# EAGLE design HVAC8-3 (EAGLE 7.5.0)
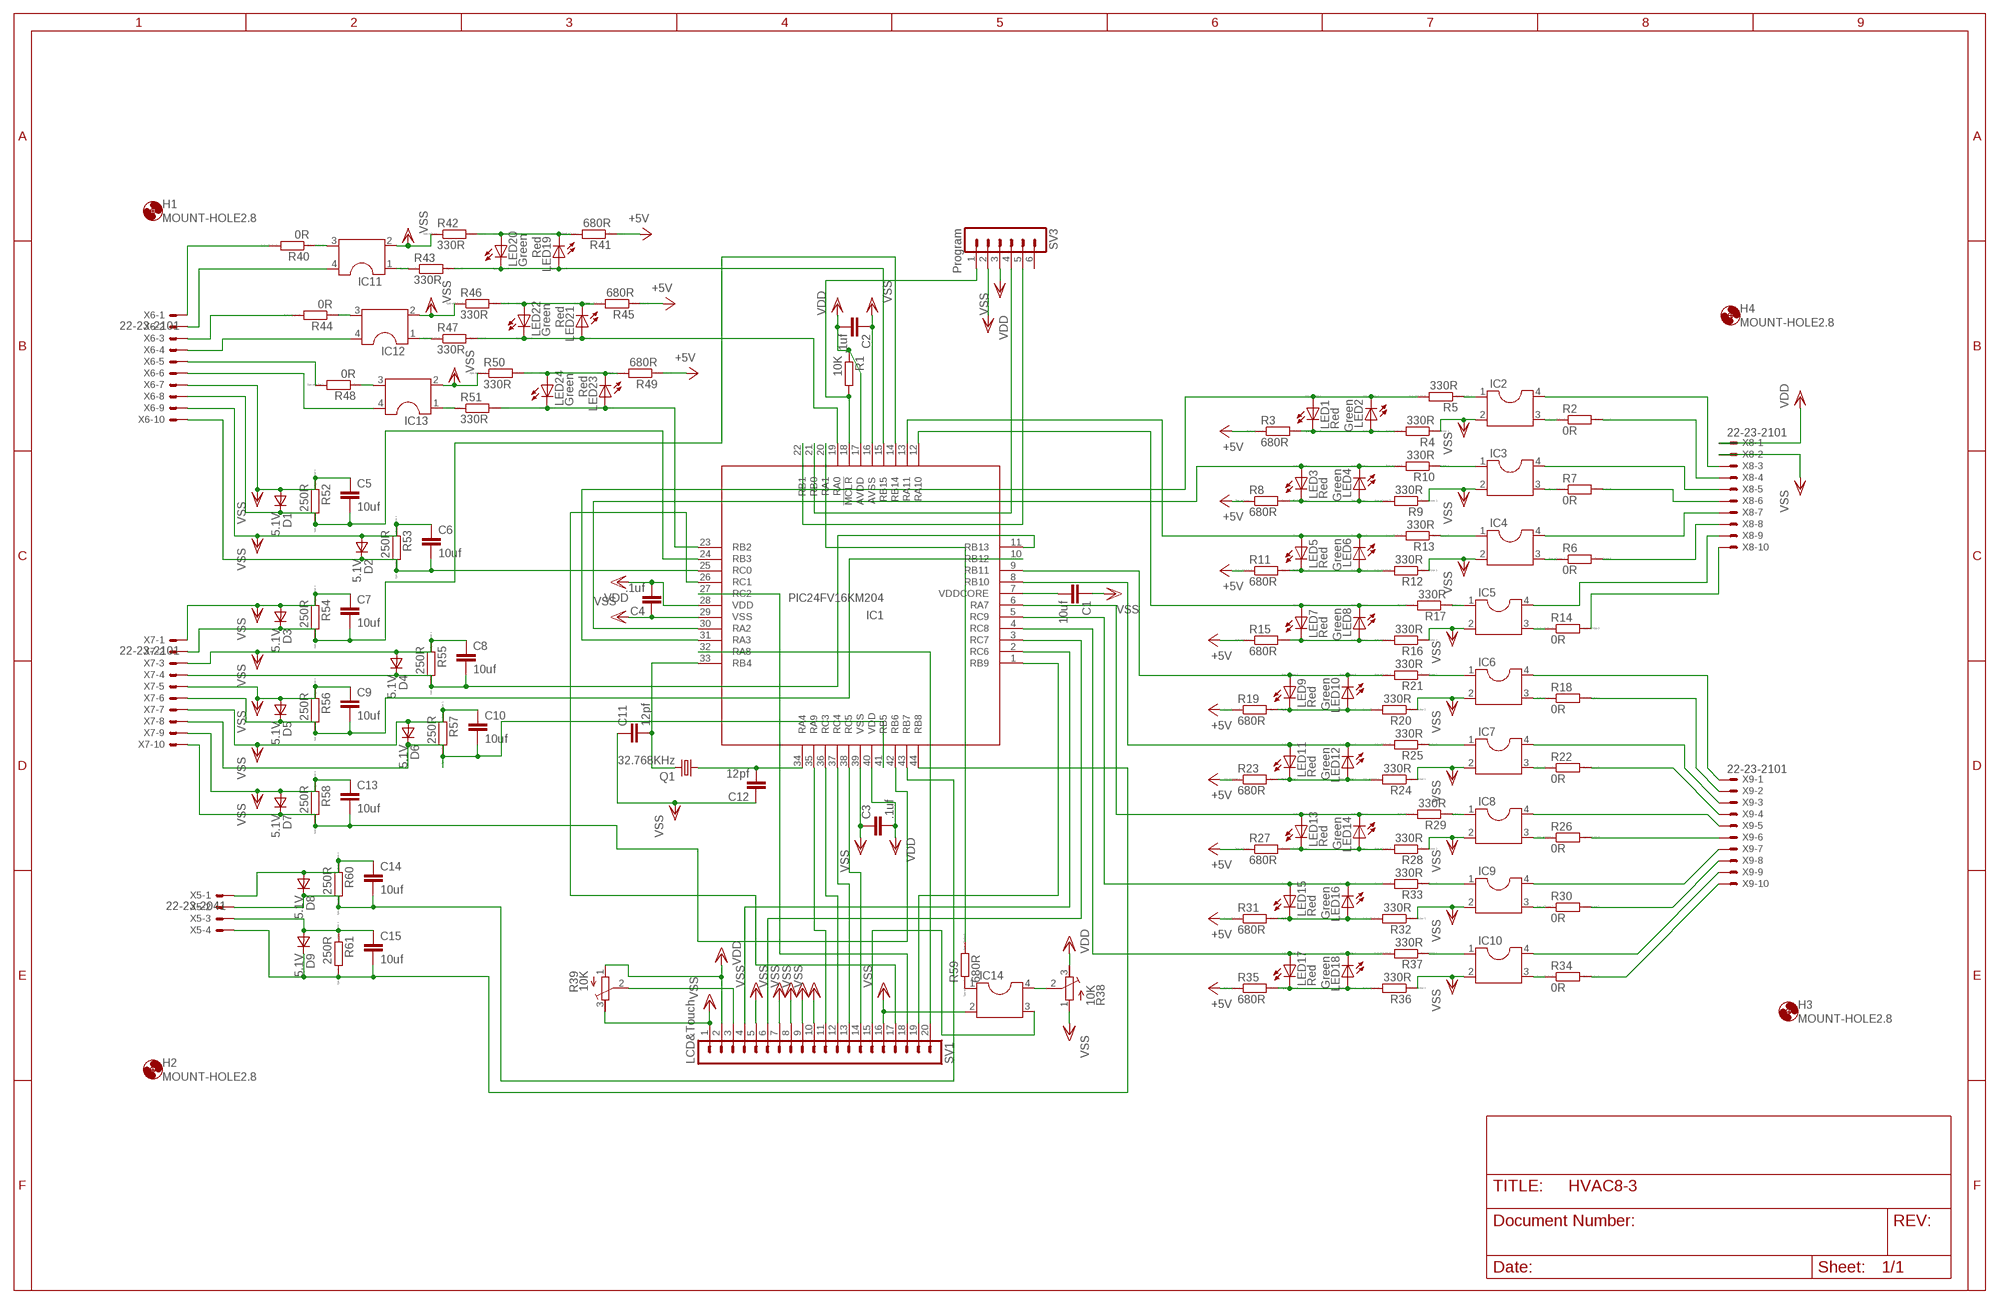
[diagram p0: schematic, sheet 1]

## Parts
C1  10uf  C-EUC1206  [C1206]
C2  .1uf  C-EUC1206  [C1206]
C3  .1uf  C-EUC1206  [C1206]
C4  .1uf  C-EUC1206  [C1206]
C5  10uf  C-EUC1206  [C1206]
C6  10uf  C-EUC1206  [C1206]
C7  10uf  C-EUC1206  [C1206]
C8  10uf  C-EUC1206  [C1206]
C9  10uf  C-EUC1206  [C1206]
C10  10uf  C-EUC1206  [C1206]
C11  12pf  C-EUC0603  [C0603]
C12  12pf  C-EUC0603  [C0603]
C13  10uf  C-EUC1206  [C1206]
C14  10uf  C-EUC1206  [C1206]
C15  10uf  C-EUC1206  [C1206]
D1  5.1V  DSOD323  [SOD323]
D2  5.1V  DSOD323  [SOD323]
D3  5.1V  DSOD323  [SOD323]
D4  5.1V  DSOD323  [SOD323]
D5  5.1V  DSOD323  [SOD323]
D6  5.1V  DSOD323  [SOD323]
D7  5.1V  DSOD323  [SOD323]
D8  5.1V  DSOD323  [SOD323]
D9  5.1V  DSOD323  [SOD323]
H1  MOUNT-HOLE2.8  [2,8]
H2  MOUNT-HOLE2.8  [2,8]
H3  MOUNT-HOLE2.8  [2,8]
H4  MOUNT-HOLE2.8  [2,8]
IC1  PIC24FV16KM204  [TQFP44]
IC2  DIL4S  [SOCKET-04]
IC3  DIL4S  [SOCKET-04]
IC4  DIL4S  [SOCKET-04]
IC5  DIL4S  [SOCKET-04]
IC6  DIL4S  [SOCKET-04]
IC7  DIL4S  [SOCKET-04]
IC8  DIL4S  [SOCKET-04]
IC9  DIL4S  [SOCKET-04]
IC10  DIL4S  [SOCKET-04]
IC11  DIL4S  [SOCKET-04]
IC12  DIL4S  [SOCKET-04]
IC13  DIL4S  [SOCKET-04]
IC14  DIL4S  [SOCKET-04]
LED1  Red  LED_E  [LED_1206]
LED2  Green  LED_E  [LED_1206]
LED3  Red  LED_E  [LED_1206]
LED4  Green  LED_E  [LED_1206]
LED5  Red  LED_E  [LED_1206]
LED6  Green  LED_E  [LED_1206]
LED7  Red  LED_E  [LED_1206]
LED8  Green  LED_E  [LED_1206]
LED9  Red  LED_E  [LED_1206]
LED10  Green  LED_E  [LED_1206]
LED11  Red  LED_E  [LED_1206]
LED12  Green  LED_E  [LED_1206]
LED13  Red  LED_E  [LED_1206]
LED14  Green  LED_E  [LED_1206]
LED15  Red  LED_E  [LED_1206]
LED16  Green  LED_E  [LED_1206]
LED17  Red  LED_E  [LED_1206]
LED18  Green  LED_E  [LED_1206]
LED19  Red  LED_E  [LED_1206]
LED20  Green  LED_E  [LED_1206]
LED21  Red  LED_E  [LED_1206]
LED22  Green  LED_E  [LED_1206]
LED23  Red  LED_E  [LED_1206]
LED24  Green  LED_E  [LED_1206]
Q1  32.768KHz  CRYSTALTC26H  [TC26H]
R1  10K  R-EU_R1206  [R1206]
R2  0R  RR1206  [R1206]
R3  680R  RR1206  [R1206]
R4  330R  RR1206  [R1206]
R5  330R  RR1206  [R1206]
R6  0R  RR1206  [R1206]
R7  0R  RR1206  [R1206]
R8  680R  RR1206  [R1206]
R9  330R  RR1206  [R1206]
R10  330R  RR1206  [R1206]
R11  680R  RR1206  [R1206]
R12  330R  RR1206  [R1206]
R13  330R  RR1206  [R1206]
R14  0R  RR1206  [R1206]
R15  680R  RR1206  [R1206]
R16  330R  RR1206  [R1206]
R17  330R  RR1206  [R1206]
R18  0R  RR1206  [R1206]
R19  680R  RR1206  [R1206]
R20  330R  RR1206  [R1206]
R21  330R  RR1206  [R1206]
R22  0R  RR1206  [R1206]
R23  680R  RR1206  [R1206]
R24  330R  RR1206  [R1206]
R25  330R  RR1206  [R1206]
R26  0R  RR1206  [R1206]
R27  680R  RR1206  [R1206]
R28  330R  RR1206  [R1206]
R29  330R  RR1206  [R1206]
R30  0R  RR1206  [R1206]
R31  680R  RR1206  [R1206]
R32  330R  RR1206  [R1206]
R33  330R  RR1206  [R1206]
R34  0R  RR1206  [R1206]
R35  680R  RR1206  [R1206]
R36  330R  RR1206  [R1206]
R37  330R  RR1206  [R1206]
R38  10K  R-TRIMM3296W  [RTRIM3296W]
R39  10K  R-TRIMM3296W  [RTRIM3296W]
R40  0R  RR1206  [R1206]
R41  680R  RR1206  [R1206]
R42  330R  RR1206  [R1206]
R43  330R  RR1206  [R1206]
R44  0R  RR1206  [R1206]
R45  680R  RR1206  [R1206]
R46  330R  RR1206  [R1206]
R47  330R  RR1206  [R1206]
R48  0R  RR1206  [R1206]
R49  680R  RR1206  [R1206]
R50  330R  RR1206  [R1206]
R51  330R  RR1206  [R1206]
R52  250R  RR1206  [R1206]
R53  250R  RR1206  [R1206]
R54  250R  RR1206  [R1206]
R55  250R  RR1206  [R1206]
R56  250R  RR1206  [R1206]
R57  250R  RR1206  [R1206]
R58  250R  RR1206  [R1206]
R59  680R  RR1206  [R1206]
R60  250R  RR1206  [R1206]
R61  250R  RR1206  [R1206]
SV1  LCD&Touch  MA20-1  [MA20-1]
SV3  Program  MA06-1  [MA06-1]
X5  22-23-2041  [22-23-2041]
X6  22-23-2101  [22-23-2101]
X7  22-23-2101  [22-23-2101]
X8  22-23-2101  [22-23-2101]
X9  22-23-2101  [22-23-2101]

## Nets
+5V: R3.1 R8.1 R11.1 R15.1 R19.1 R23.1 R27.1 R31.1 R35.1 R41.1 R45.1 R49.1
N$1: IC13.1 R51.1
N$2: IC1.18(!MCLR) R1.2 SV3.1
N$3: IC2.1 R5.1
N$4: IC1.12(RA10) LED7.A LED8.C R17.2
N$5: IC2.4 X8.3
N$6: LED1.C LED2.A R3.2 R4.2
N$7: IC2.3 R2.1
N$8: IC3.1 R10.1
N$9: R2.2 X8.4
N$10: IC3.4 X8.5
N$11: LED3.C LED4.A R8.2 R9.2
N$12: IC3.3 R7.1
N$13: IC11.1 R43.1
N$14: R7.2 X8.6
N$15: IC4.1 R13.1
N$16: LED5.C LED6.A R11.2 R12.2
N$17: IC4.3 R6.1
N$18: LED19.C LED20.A R41.2 R42.2
N$19: R14.2 X8.10
N$20: IC5.4 X8.9
N$21: IC5.1 R17.1
N$22: LED7.C LED8.A R15.2 R16.2
N$23: IC5.3 R14.1
N$24: IC6.1 R21.1
N$25: LED9.C LED10.A R19.2 R20.2
N$26: IC6.3 R18.1
N$27: R6.2 X8.8
N$28: IC4.4 X8.7
N$29: IC11.3 R40.1
N$30: IC6.4 X9.1
N$31: R18.2 X9.2
N$32: IC12.1 R47.1
N$33: IC7.1 R25.1
N$34: LED11.C LED12.A R23.2 R24.2
N$35: IC7.3 R22.1
N$36: IC1.9(RB11) LED9.A LED10.C R21.2
N$37: IC7.4 X9.3
N$38: R22.2 X9.4
N$39: IC8.1 R29.1
N$40: LED13.C LED14.A R27.2 R28.2
N$41: IC8.3 R26.1
N$42: IC9.1 R33.1
N$43: LED15.C LED16.A R31.2 R32.2
N$44: IC9.3 R30.1
N$45: IC1.5(RC9) LED15.A LED16.C R33.2
N$46: IC1.15(RB15) LED19.A LED20.C R43.2
N$47: IC10.1 R37.1
N$48: LED17.C LED18.A R35.2 R36.2
N$49: IC10.3 R34.1
N$50: IC1.4(RC8) LED17.A LED18.C R37.2
N$51: IC8.4 X9.5
N$52: R26.2 X9.6
N$53: IC9.4 X9.7
N$54: R30.2 X9.8
N$55: IC10.4 X9.9
N$56: R34.2 X9.10
N$57: LED21.C LED22.A R45.2 R46.2
N$58: IC12.3 R44.1
N$59: IC1.19(RA0) LED21.A LED22.C R47.2
N$60: R40.2 X6.1
N$61: IC1.6(RA7) LED13.A LED14.C R29.2
N$62: IC11.4 X6.2
N$63: R39.2(S) SV1.3
N$64: R44.2 X6.3
N$65: IC12.4 X6.4
N$66: IC1.3(RC7) SV1.6
N$67: IC1.8(RB10) LED11.A LED12.C R25.2
N$68: IC1.2(RC6) SV1.4
N$69: IC1.31(RA3) LED1.A LED2.C R5.2
N$70: IC1.13(RA11) LED5.A LED6.C R13.2
N$71: IC1.30(RA2) LED3.A LED4.C R10.2
N$72: IC1.35(RA9) SV1.11
N$73: IC1.36(RC3) SV1.12
N$74: IC1.37(RC4) SV1.13
N$75: IC1.38(RC5) SV1.14
N$76: IC14.3 SV1.15
N$77: LED23.C LED24.A R49.2 R50.2
N$78: IC13.3 R48.1
N$79: IC1.23(RB2) LED23.A LED24.C R51.2
N$80: R48.2 X6.5
N$81: IC13.4 X6.6
N$82: IC14.4 R38.2(S)
N$83: C5.2 D1.1(C) IC1.24(RB3) R52.2 X6.8
N$84: IC1.26(RC1) SV1.17
N$85: C6.2 D2.1(C) IC1.25(RC0) R53.2 X6.10
N$86: IC1.27(RC2) SV1.18
N$87: C7.2 D3.1(C) IC1.14(RB14) R54.2 X7.2
N$88: IC1.1(RB9) SV1.19
N$89: C8.2 D4.1(C) IC1.11(RB13) R55.2 X7.4
N$90: IC1.32(RA8) SV1.20
N$91: IC1.22(RB1) SV3.5
N$92: C9.2 D5.1(C) IC1.10(RB12) R56.2 X7.6
N$93: C10.2 D6.1(C) IC1.41(RB5) R57.2 X7.8
N$94: IC1.21(RB0) SV3.4
N$95: C12.2 IC1.34(RA4) Q1.1
N$96: C11.2 IC1.33(RB4) Q1.2
N$97: C13.2 D7.1(C) IC1.42(RB6) R58.2 X7.10
N$98: IC14.1 R59.1
N$99: IC1.20(RA1) R59.2
N$100: C14.1 D8.2(A) R60.1 X5.1
N$101: C14.2 D8.1(C) IC1.43(RB7) R60.2 X5.2
N$102: C15.1 D9.2(A) R61.1 X5.3
N$103: C15.2 D9.1(C) IC1.44(RB8) R61.2 X5.4
VDD: C2.2 C3.2 C4.2 IC1.17(AVDD) IC1.28(VDD) IC1.40(VDD) R1.1 R38.3(E) R39.1(A) SV1.2 SV3.2 X8.1
VDDCORENET: C1.2 IC1.7(VDDCORE)
VSS: C1.1 C2.1 C3.1 C4.1 C5.1 C6.1 C7.1 C8.1 C9.1 C10.1 C11.1 C12.1 C13.1 D1.2(A) D2.2(A) D3.2(A) D4.2(A) D5.2(A) D6.2(A) D7.2(A) IC1.16(AVSS) IC1.29(VSS) IC1.39(VSS) IC2.2 IC3.2 IC4.2 IC5.2 IC6.2 IC7.2 IC8.2 IC9.2 IC10.2 IC11.2 IC12.2 IC13.2 IC14.2 R4.1 R9.1 R12.1 R16.1 R20.1 R24.1 R28.1 R32.1 R36.1 R38.1(A) R39.3(E) R42.1 R46.1 R50.1 R52.1 R53.1 R54.1 R55.1 R56.1 R57.1 R58.1 SV1.1 SV1.5 SV1.7 SV1.8 SV1.9 SV1.10 SV1.16 SV3.3 X6.7 X6.9 X7.1 X7.3 X7.5 X7.7 X7.9 X8.2
Unconnected: SV3.6

## Library data of the parts
C1-C15 = rcl:C-EU: CAPACITOR, European symbol
D1-D9 = zetex:D: DIODE; MPN: CDSOD323-T05C; OC_FARNELL: 1824860; OC_NEWARK: 79R6078
H1-H4 = holes:MOUNT-HOLE: MOUNTING HOLE with drill center marker
IC1 = microchip:PIC24FV16KM204: PIC24FV16KM204 TQFP-44 Auto generated by make-symbol-device-package-bsdl.ulp Rev. 25 Edited by Dave Source: PIC24FJ64GA004.bsd; MPN: PIC24FV16KM204; OC_FARNELL: 1332299; OC_NEWARK: 98M1927
IC2-IC14 = ic-package:DIL4: Dual In Line / Socket
LED1-LED24 = eagle-ltspice:LED_E: LED Source: http://www.osram.convergy.de Source: www.luxeon.com Source: www.kingbright.com; SPICEMODEL: NONE; SPICEPREFIX: D; SPICETYPE: diode
Q1 = crystal:CRYSTAL: CRYSTAL; OC_FARNELL: unknown; OC_NEWARK: unknown
R1 = rcl:R-EU_: RESISTOR, European symbol
R2-R37 R40-R61 = eagle-ltspice:R: RESISTOR, European symbol; SPICEMODEL: NONE; SPICEPREFIX: R
R38 R39 = rcl:R-TRIMM: Trimm resistor
SV1 = con-lstb:MA20-1: PIN HEADER; OC_FARNELL: unknown; OC_NEWARK: unknown
SV3 = con-lstb:MA06-1: PIN HEADER; OC_FARNELL: unknown; OC_NEWARK: unknown
X5 = con-molex:22-23-2041: .100" (2.54mm) Center Header - 4 Pin; MF: MOLEX; MPN: 22-23-2041; OC_FARNELL: 1462920; OC_NEWARK: 38C0355
X6-X9 = con-molex:22-23-2101: .100" (2.54mm) Center Header - 10 Pin; MF: MOLEX; MPN: 22-23-2101; OC_FARNELL: 1756828; OC_NEWARK: 94C0765

## Board
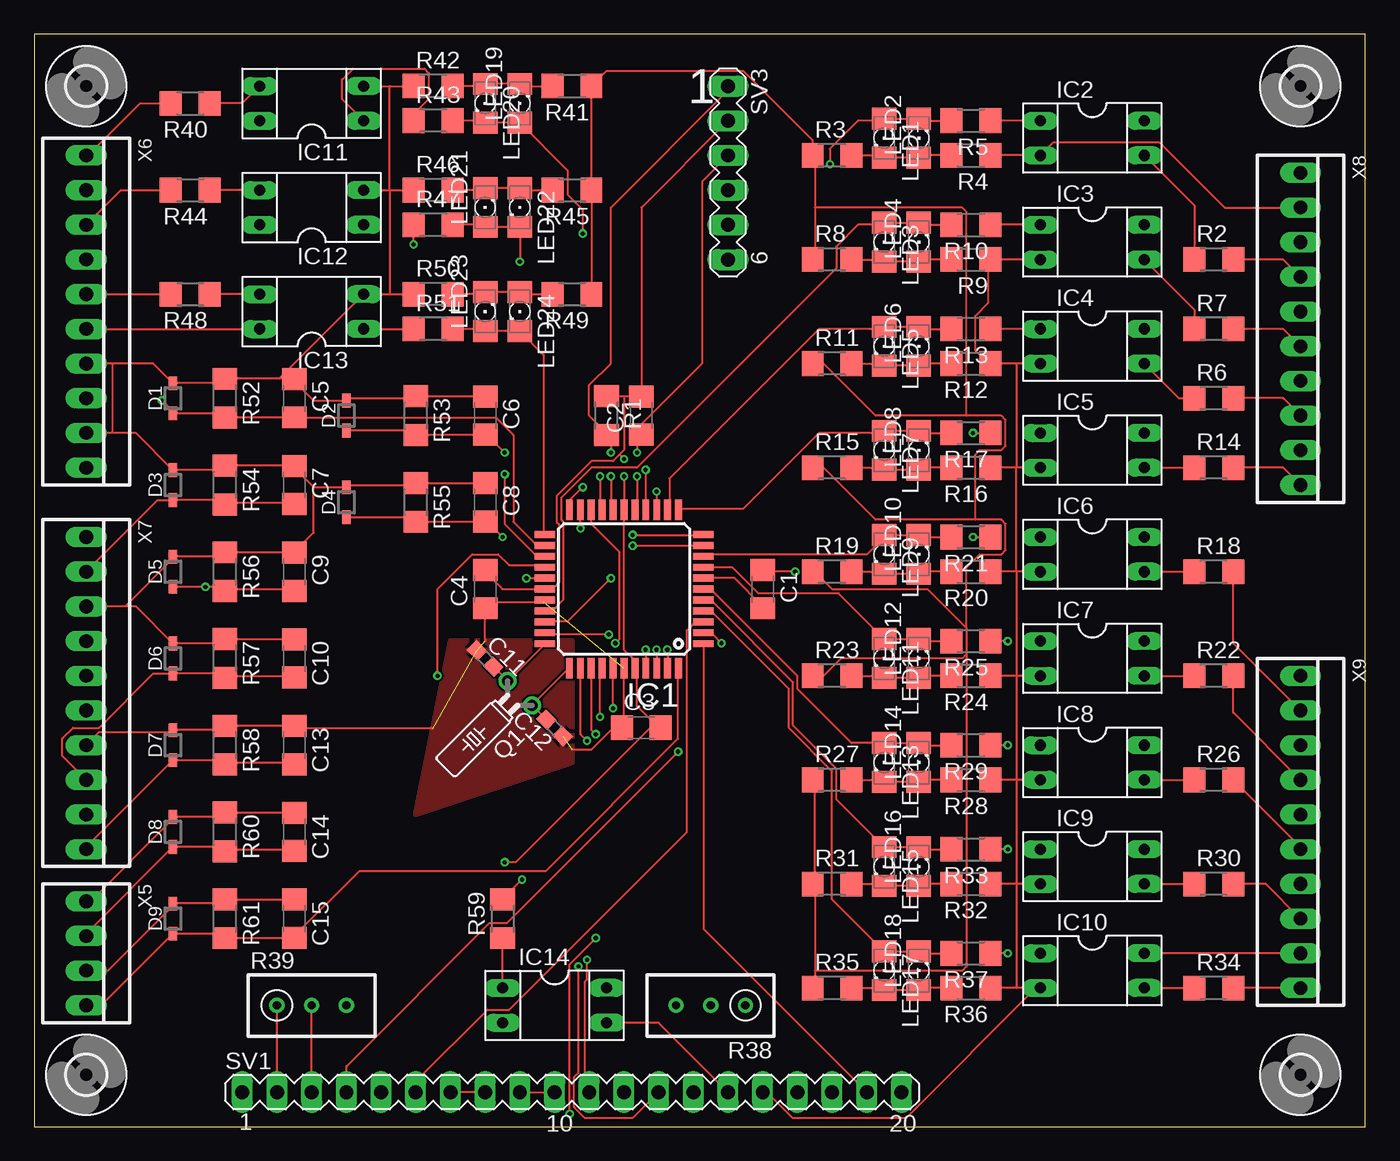
[diagram p1: board, top side]
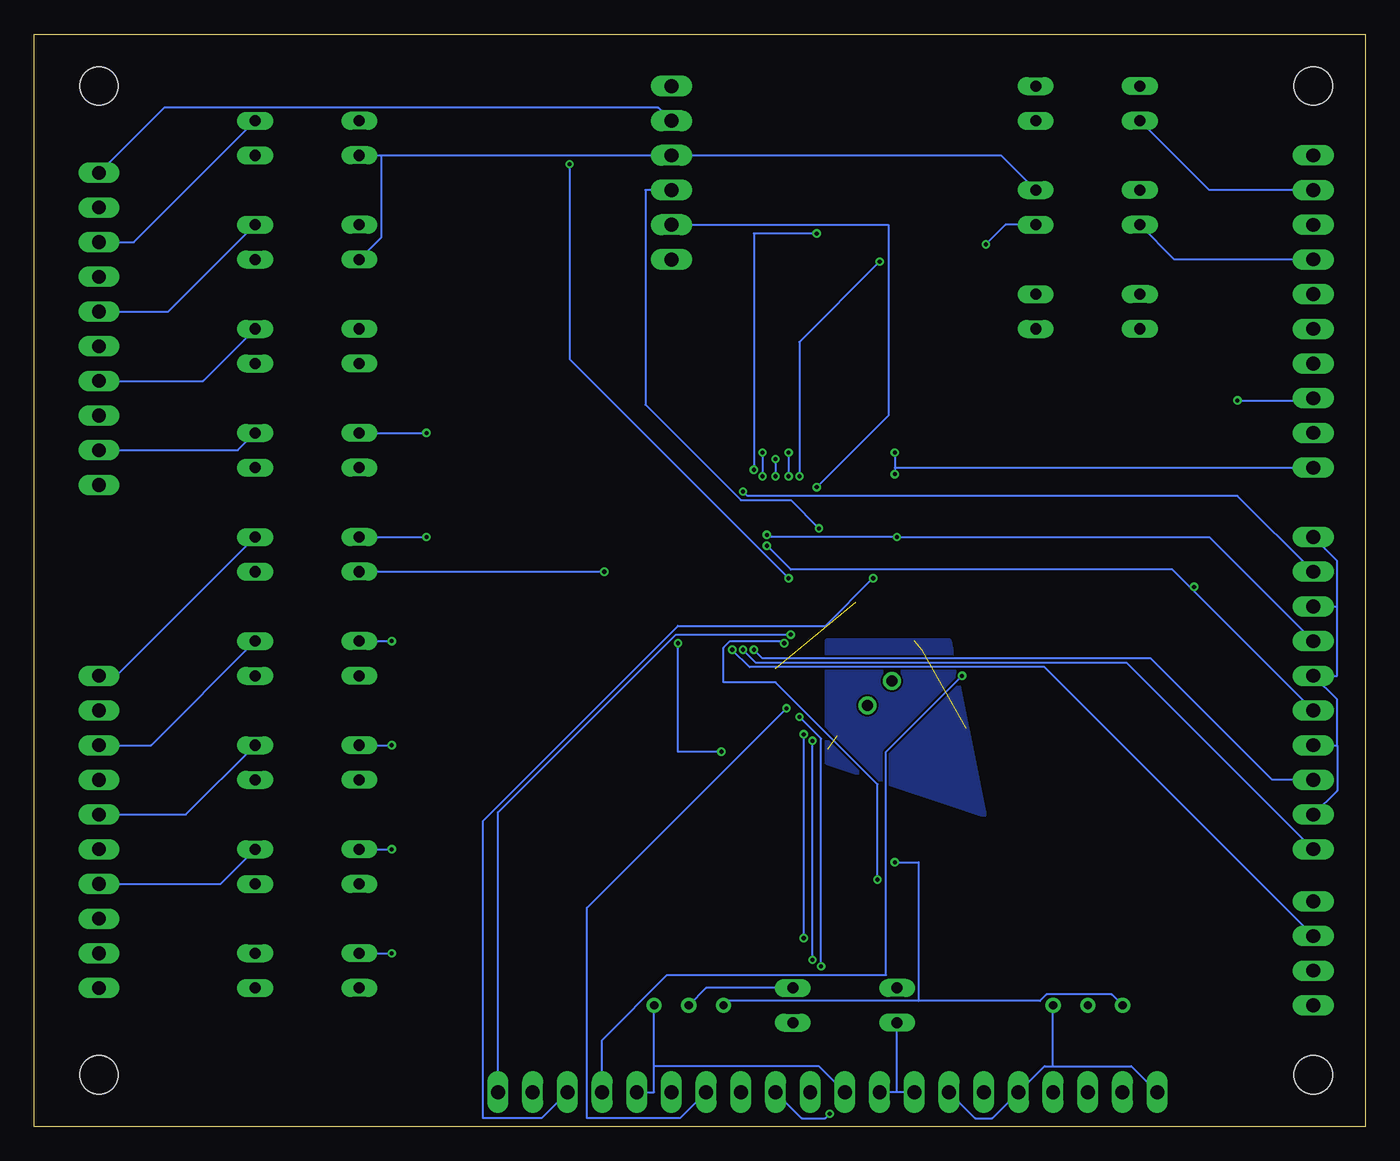
[diagram p2: board, bottom side, seen from below]

Size 97.46 x 80 mm. Coordinates in mm from the lower left corner, seen from the top.
Outline: 0,0 97.46,0 97.46,80 0,80 0,0
Copper layers (1*16): Top 0.035mm / dielectric 1.5mm / Bottom 0.035mm
Design rules "SeeedStudio_2layer_DRU_no_angle_20140221": minimum track width 6mil, minimum drill 12mil, track to track 6mil, track to pad 6mil, pad to pad 6mil, via to via 6mil, smd to smd 0mil, copper to edge 10mil, drill to drill 10mil, minimum pad ring 10mil, minimum via ring 6mil, stop-mask expansion 2mil, vias tented up to drill 100mil, thermal gap 10mil

### Footprints (pad centres in the part's own frame; a part is rotated, then mirrored left to right if it is on the bottom)
C1206 = smd 1.6 x 1.8: 1 -1.4,0; 2 1.4,0
C0603 = smd 1.1 x 1: 1 -0.85,0; 2 0.85,0
SOD323 = smd 1 x 0.6: 1 -1.1,0; 2 1.1,0
2,8 = hole 2.8: 0,0
TQFP44 = smd 1.5 x 0.5: 1 -5.8,4; 2 -5.8,3.2; 3 -5.8,2.4; 4 -5.8,1.6; 5 -5.8,0.8; 6 -5.8,0; 7 -5.8,-0.8; 8 -5.8,-1.6; 9 -5.8,-2.4; 10 -5.8,-3.2; 11 -5.8,-4; 23 5.8,-4; 24 5.8,-3.2; 25 5.8,-2.4; 26 5.8,-1.6; 27 5.8,-0.8; 28 5.8,0; 29 5.8,0.8; 30 5.8,1.6; 31 5.8,2.4; 32 5.8,3.2; 33 5.8,4 | smd 0.5 x 1.5: 12 -4,-5.8; 13 -3.2,-5.8; 14 -2.4,-5.8; 15 -1.6,-5.8; 16 -0.8,-5.8; 17 0,-5.8; 18 0.8,-5.8; 19 1.6,-5.8; 20 2.4,-5.8; 21 3.2,-5.8; 22 4,-5.8; 34 4,5.8; 35 3.2,5.8; 36 2.4,5.8; 37 1.6,5.8; 38 0.8,5.8; 39 0,5.8; 40 -0.8,5.8; 41 -1.6,5.8; 42 -2.4,5.8; 43 -3.2,5.8; 44 -4,5.8
SOCKET-04 = drill 0.813 long: 1 -1.27,-3.81; 2 1.27,-3.81; 3 1.27,3.81; 4 -1.27,3.81
LED_1206 = smd 1.6 x 1.803: A -1.422,0; C 1.422,0
TC26H = drill 0.813: 1 -1.27,0; 2 1.27,0
R1206 = smd 1.6 x 1.803: 1 -1.422,0; 2 1.422,0
RTRIM3296W = drill 0.61: 1 0,-2.54; 2 0,0; 3 0,2.54
MA20-1 = drill 1.016 long: 1 -24.13,0; 2 -21.59,0; 3 -19.05,0; 4 -16.51,0; 5 -13.97,0; 6 -11.43,0; 7 -8.89,0; 8 -6.35,0; 9 -3.81,0; 10 -1.27,0; 11 1.27,0; 12 3.81,0; 13 6.35,0; 14 8.89,0; 15 11.43,0; 16 13.97,0; 17 16.51,0; 18 19.05,0; 19 21.59,0; 20 24.13,0
MA06-1 = drill 1.016 long: 1 -6.35,0; 2 -3.81,0; 3 -1.27,0; 4 1.27,0; 5 3.81,0; 6 6.35,0
22-23-2041 = drill 1 long: 1 -3.81,0; 2 -1.27,0; 3 1.27,0; 4 3.81,0
22-23-2101 = drill 1 long: 1 -11.43,0; 2 -8.89,0; 3 -6.35,0; 4 -3.81,0; 5 -1.27,0; 6 1.27,0; 7 3.81,0; 8 6.35,0; 9 8.89,0; 10 11.43,0

### Placement (x,y rotation side)
C1  53.34,39.37 270 top
C2  44.45,52.07 90 top
C3  44.45,29.21 0 top
C4  33.02,39.37 90 top
C5  19.05,53.34 270 top
C6  33.02,52.07 270 top
C7  19.05,46.99 270 top
C8  33.02,45.72 270 top
C9  19.05,40.64 270 top
C10  19.05,34.29 270 top
C11  33.02,34.29 315 top
C12  38.1,29.21 135 top
C13  19.05,27.94 270 top
C14  19.05,21.59 270 top
C15  19.05,15.24 270 top
D1  10.16,53.34 90 top
D2  22.86,52.07 90 top
D3  10.16,46.99 90 top
D4  22.86,45.72 90 top
D5  10.16,40.64 90 top
D6  10.16,34.29 90 top
D7  10.16,27.94 90 top
D8  10.16,21.59 90 top
D9  10.16,15.24 90 top
H1  3.81,3.81 0 top
H2  92.71,3.81 0 top
H3  92.71,76.2 0 top
H4  3.81,76.2 0 top
IC1  43.18,39.37 180 top
IC2  77.47,72.39 270 top
IC3  77.47,64.77 270 top
IC4  77.47,57.15 270 top
IC5  77.47,49.53 270 top
IC6  77.47,41.91 270 top
IC7  77.47,34.29 270 top
IC8  77.47,26.67 270 top
IC9  77.47,19.05 270 top
IC10  77.47,11.43 270 top
IC11  20.32,74.93 90 top
IC12  20.32,67.31 90 top
IC13  20.32,59.69 90 top
IC14  38.1,8.89 270 top
LED1  62.23,72.39 270 top
LED2  64.77,72.39 90 top
LED3  62.23,64.77 270 top
LED4  64.77,64.77 90 top
LED5  62.23,57.15 270 top
LED6  64.77,57.15 90 top
LED7  62.23,49.53 270 top
LED8  64.77,49.53 90 top
LED9  62.23,41.91 270 top
LED10  64.77,41.91 90 top
LED11  62.23,34.29 270 top
LED12  64.77,34.29 90 top
LED13  62.23,26.67 270 top
LED14  64.77,26.67 90 top
LED15  62.23,19.05 270 top
LED16  64.77,19.05 90 top
LED17  62.23,11.43 270 top
LED18  64.77,11.43 90 top
LED19  35.56,74.93 90 top
LED20  33.02,74.93 270 top
LED21  33.02,67.31 90 top
LED22  35.56,67.31 270 top
LED23  33.02,59.69 90 top
LED24  35.56,59.69 270 top
Q1  35.56,31.75 135 top
R1  41.91,52.07 270 top
R2  86.36,63.5 0 top
R3  58.42,71.12 0 top
R4  68.58,71.12 180 top
R5  68.58,73.66 180 top
R6  86.36,53.34 0 top
R7  86.36,58.42 0 top
R8  58.42,63.5 0 top
R9  68.58,63.5 180 top
R10  68.58,66.04 180 top
R11  58.42,55.88 0 top
R12  68.58,55.88 180 top
R13  68.58,58.42 180 top
R14  86.36,48.26 0 top
R15  58.42,48.26 0 top
R16  68.58,48.26 180 top
R17  68.58,50.8 180 top
R18  86.36,40.64 0 top
R19  58.42,40.64 0 top
R20  68.58,40.64 180 top
R21  68.58,43.18 180 top
R22  86.36,33.02 0 top
R23  58.42,33.02 0 top
R24  68.58,33.02 180 top
R25  68.58,35.56 180 top
R26  86.36,25.4 0 top
R27  58.42,25.4 0 top
R28  68.58,25.4 180 top
R29  68.58,27.94 180 top
R30  86.36,17.78 0 top
R31  58.42,17.78 0 top
R32  68.58,17.78 180 top
R33  68.58,20.32 180 top
R34  86.36,10.16 0 top
R35  58.42,10.16 0 top
R36  68.58,10.16 180 top
R37  68.58,12.7 180 top
R38  49.53,8.89 90 top
R39  20.32,8.89 270 top
R40  11.43,74.93 180 top
R41  39.37,76.2 180 top
R42  29.21,76.2 0 top
R43  29.21,73.66 0 top
R44  11.43,68.58 180 top
R45  39.37,68.58 180 top
R46  29.21,68.58 0 top
R47  29.21,66.04 0 top
R48  11.43,60.96 180 top
R49  39.37,60.96 180 top
R50  29.21,60.96 0 top
R51  29.21,58.42 0 top
R52  13.97,53.34 270 top
R53  27.94,52.07 270 top
R54  13.97,46.99 270 top
R55  27.94,45.72 270 top
R56  13.97,40.64 270 top
R57  13.97,34.29 270 top
R58  13.97,27.94 270 top
R59  34.29,15.24 90 top
R60  13.97,21.59 270 top
R61  13.97,15.24 270 top
SV1  39.37,2.54 0 top
SV3  50.8,69.85 270 top
X5  3.81,12.7 270 top
X6  3.81,59.69 270 top
X7  3.81,31.75 270 top
X8  92.71,58.42 270 top
X9  92.71,21.59 270 top

### Tracks (layer width: path | path; a pad name or v marks a point on that pad's centre or on a via)
+5V
  Top 0.152: 57.15,67.31 57.15,71.12 R3.1 56.99,72.23 51.91,77.31 41.91,77.31 R41.1 | 57.15,67.31 57.15,63.5 R8.1 | R45.1 R49.1 | R45.1 R41.1 | R45.1 | R41.1 | 57.15,17.78 57.15,11.43 | 57.15,11.43 57.15,10.16 R35.1 | 57.15,17.78 57.15,25.4 R27.1 | 57.15,17.78 R31.1 | R23.1 57.78,33.02 59.05,34.29 67.94,34.29 68.26,34.61 | 68.26,36.51 68.26,34.61 | 68.26,36.51 65.41,39.37 58.42,39.37 57.15,40.64 R19.1 | R15.1 57.78,48.26 61.59,44.45 68.9,44.45 | 68.9,44.45 70.8,44.45 71.12,44.13 71.12,42.23 70.8,41.91 69.22,41.91 68.26,40.96 68.26,36.51 | R11.1 57.78,55.88 61.59,52.07 68.26,52.07 | 68.26,52.07 70.8,52.07 71.12,51.75 71.12,49.85 70.8,49.53 69.22,49.53 68.9,49.21 68.9,44.45 | 57.15,11.43 67.94,11.43 68.26,11.75 68.26,34.61 | 57.15,67.31 67.94,67.31 68.26,66.99 68.26,52.07
N$1
  Top 0.152: IC13.1 R51.1
N$2  (via drill 0.3)
  Top 0.152: v42.23,47.62 42.23,45.24 IC1.18 | v42.23,49.37 42.23,50.32 R1.2 41.91,50.8 40.64,52.07 40.64,54.29 42.23,55.88 42.23,67.31 50.8,75.88 SV3.1
  Bottom 0.152: v42.23,49.37 v42.23,47.62
N$3
  Top 0.152: IC2.1 R5.1
N$4
  Top 0.152: R17.2 64.77,50.8 LED8.C LED7.A 62.23,50.8 57.47,50.8 51.91,45.24 47.31,45.24 IC1.12
N$5
  Bottom 0.152: IC2.4 90.17,64.77 X8.3
N$6
  Top 0.152: R3.2 62.23,71.12 LED1.C LED2.A 64.77,71.12 R4.2
N$7
  Top 0.152: IC2.3 84.93,67.47 R2.1
N$8
  Top 0.152: IC3.1 R10.1
N$9
  Top 0.152: R2.2 91.44,63.5 X8.4
N$10
  Bottom 0.152: IC3.4 87.63,59.69 X8.5
N$11
  Top 0.152: R8.2 62.23,63.5 LED3.C LED4.A 64.77,63.5 R9.2
N$12
  Top 0.152: IC3.3 84.93,59.85 R7.1
N$13
  Top 0.152: IC11.1 22.54,75.25 22.54,76.68 23.34,77.47 28.57,77.47 28.89,77.15 28.89,75.25 27.94,74.3 27.94,73.66 R43.1
N$14
  Top 0.152: R7.2 91.44,58.42 X8.6
N$15
  Top 0.152: IC4.1 R13.1
N$16
  Top 0.152: R11.2 62.23,55.88 LED5.C LED6.A 64.77,55.88 R12.2
N$17
  Top 0.152: R6.1 83.82,53.34 IC4.3
N$18
  Top 0.152: R42.2 33.02,76.2 LED20.A LED19.C 35.56,76.2 R41.2
N$19
  Top 0.152: R14.2 91.44,48.26 X8.10
N$20
  Bottom 0.152: IC5.4 82.55,49.53 X8.9
N$21  (via drill 0.3)
  Top 0.152: v68.74,50.8 R17.1
  Bottom 0.152: IC5.1 v68.74,50.8
N$22
  Top 0.152: R15.2 62.23,48.26 LED7.C LED8.A 64.77,48.26 R16.2
N$23
  Top 0.152: IC5.3 R14.1
N$24  (via drill 0.3)
  Top 0.152: v68.74,43.18 R21.1
  Bottom 0.152: IC6.1 v68.74,43.18
N$25
  Top 0.152: R19.2 62.23,40.64 LED9.C LED10.A 64.77,40.64 R20.2
N$26
  Top 0.152: IC6.3 R18.1
N$27
  Top 0.152: R6.2 91.44,53.34 X8.8
N$28
  Bottom 0.152: IC4.4 85.09,54.61 X8.7
N$29
  Top 0.152: R40.1 15.24,74.93 IC11.3
N$30
  Bottom 0.152: IC6.4 91.44,33.02 X9.1
N$31
  Top 0.152: X9.2 87.79,35.4 R18.2
N$32  (via drill 0.3)
  Top 0.152: v27.78,64.61 R47.1
  Bottom 0.152: v27.78,64.61 26.35,66.04 IC12.1
N$33  (via drill 0.3)
  Top 0.152: v71.28,35.56 R25.1
  Bottom 0.152: IC7.1 v71.28,35.56
N$34
  Top 0.152: R23.2 62.23,33.02 LED11.C LED12.A 64.77,33.02 R24.2
N$35
  Top 0.152: IC7.3 R22.1
N$36
  Top 0.152: R21.2 64.77,43.18 LED10.C LED9.A 62.23,43.18 60.96,41.91 49.05,41.91 IC1.9
N$37
  Bottom 0.152: IC7.4 88.9,27.94 X9.3
N$38
  Top 0.152: X9.4 87.79,30.32 R22.2
N$39  (via drill 0.3)
  Top 0.152: v71.28,27.94 R29.1
  Bottom 0.152: IC8.1 v71.28,27.94
N$40
  Top 0.152: R27.2 62.23,25.4 LED13.C LED14.A 64.77,25.4 R28.2
N$41
  Top 0.152: IC8.3 R26.1
N$42  (via drill 0.3)
  Top 0.152: v71.28,20.32 R33.1
  Bottom 0.152: IC9.1 v71.28,20.32
N$43
  Top 0.152: R31.2 62.23,17.78 LED15.C LED16.A 64.77,17.78 R32.2
N$44
  Top 0.152: IC9.3 R30.1
N$45
  Top 0.152: R33.2 64.77,20.32 LED16.C LED15.A | LED15.A 58.74,23.97 58.74,26.19 55.56,29.37 55.56,32.54 49.69,38.42 49.05,38.42 IC1.5 | LED15.A
N$46  (via drill 0.3)
  Top 0.152: R43.2 33.02,73.66 LED20.C LED19.A | v44.77,48.1 44.77,45.24 IC1.15 | v40.16,65.41 40.16,67.15 39.05,68.26 39.05,70.01 LED19.A | LED19.A
  Bottom 0.152: v44.77,48.1 44.77,65.41 v40.16,65.41
N$47  (via drill 0.3)
  Top 0.152: v71.28,12.7 R37.1
  Bottom 0.152: IC10.1 v71.28,12.7
N$48
  Top 0.152: R35.2 62.23,10.16 LED17.C LED18.A 64.77,10.16 R36.2
N$49
  Top 0.152: IC10.3 R34.1
N$50
  Top 0.152: R37.2 64.77,12.7 LED18.C LED17.A | LED17.A 58.42,16.67 58.42,26.04 55.24,29.21 55.24,32.07 49.69,37.62 49.05,37.62 IC1.4 | LED17.A
N$51
  Bottom 0.152: IC8.4 86.36,22.86 X9.5
N$52
  Top 0.152: X9.6 92.71,20.48 R26.2
N$53
  Bottom 0.152: IC9.4 83.82,17.78 X9.7
N$54
  Top 0.152: R30.2 90.17,17.78 X9.8
N$55
  Top 0.152: X9.9 IC10.4
N$56
  Top 0.152: X9.10 R34.2
N$57
  Top 0.152: R46.2 33.02,68.58 LED21.C LED22.A 35.56,68.58 R45.2
N$58
  Top 0.152: IC12.3 R44.1
N$59  (via drill 0.3)
  Top 0.152: R47.2 33.02,66.04 LED21.A LED22.C | v41.43,47.62 41.43,45.24 IC1.19 | LED22.C v35.56,63.34 | LED22.C
  Bottom 0.152: v41.43,47.62 41.43,57.47 v35.56,63.34
N$60
  Top 0.152: R40.2 7.78,74.93 3.97,71.12 X6.1
N$61
  Top 0.152: R29.2 64.77,27.94 LED14.C LED13.A | IC1.6 49.53,39.37 55.88,33.02 55.88,32.07 59.85,28.1 LED13.A | LED13.A
N$62
  Bottom 0.152: IC11.4 11.43,68.58 X6.2
N$63
  Top 0.152: SV1.3 R39.2
N$64
  Top 0.152: R44.2 6.35,68.58 X6.3
N$65
  Bottom 0.152: IC12.4 13.97,63.5 X6.4
N$66
  Top 0.152: SV1.6 27.94,3.33 33.18,8.57 34.77,8.57 47.78,21.59 47.78,36.35 48.26,36.83 48.9,36.83 IC1.3
N$67
  Top 0.152: R25.2 64.77,35.56 LED12.C LED11.A | LED11.A 58.9,39.05 53.02,39.05 51.12,40.96 49.05,40.96 IC1.8 | LED11.A
N$68  (via drill 0.3)
  Top 0.152: v50.32,35.4 49.69,36.04 49.05,36.04 IC1.2 | v47.15,27.46 34.61,14.92 33.34,14.92 22.86,4.45 SV1.4
  Bottom 0.152: v50.32,35.4 50.32,27.46 v47.15,27.46
N$69  (via drill 0.3)
  Top 0.152: R5.2 64.77,73.66 LED2.C LED1.A 62.23,73.66 60.33,73.66 58.26,71.6 v58.26,70.48 | v42.23,40.16 39.05,36.99 37.47,36.99 IC1.31
  Bottom 0.152: v42.23,40.16 58.26,56.2 v58.26,70.48
N$70
  Top 0.152: R13.2 64.77,58.42 LED6.C LED5.A 62.23,58.42 57.47,58.42 46.51,47.47 46.51,45.24 IC1.13
N$71
  Top 0.152: R10.2 64.77,66.04 LED4.C LED3.A 62.23,66.04 60.33,66.04 58.74,64.45 58.74,62.87 44.13,48.26 40.8,48.26 38.58,46.04 38.58,44.45 38.73,44.29 38.73,38.58 37.94,37.78 37.47,37.78 IC1.30
N$72  (via drill 0.3)
  Top 0.152: v40.48,28.26 40.01,28.73 40.01,33.5 IC1.35 | v40.48,12.22 40.48,10.79 40.32,10.64 40.32,2.86 SV1.11
  Bottom 0.152: v40.48,12.22 v40.48,28.26
N$73  (via drill 0.3)
  Top 0.152: v41.12,28.73 40.8,29.05 40.8,33.5 IC1.36 | v41.12,13.81 39.21,11.91 v39.21,0.95
  Bottom 0.152: v41.12,13.81 v41.12,28.73 | v39.21,0.95 39.53,0.64 41.27,0.64 SV1.12
N$74  (via drill 0.3)
  Top 0.152: v41.43,30 41.43,33.5 IC1.37 | v39.85,11.75 39.85,3.97 39.53,3.65 39.53,1.43 40.32,0.64 43.81,0.64 SV1.13
  Bottom 0.152: v41.43,30 39.85,28.42 v39.85,11.75
N$75  (via drill 0.3)
  Top 0.152: v42.39,30.64 42.39,33.5 IC1.38
  Bottom 0.152: v42.39,30.64 56.99,16.03 56.99,0.64 50.16,0.64 SV1.14
N$76
  Top 0.152: IC14.3 45.72,7.62 SV1.15
N$77
  Top 0.152: R50.2 33.02,60.96 LED23.C LED24.A 35.56,60.96 R49.2
N$78
  Top 0.152: IC13.3 R48.1
N$79
  Top 0.152: R51.2 33.02,58.42 LED23.A LED24.C | LED24.C 37.31,56.52 37.31,43.5 IC1.23 | LED24.C
N$80
  Top 0.152: X6.5 R48.2
N$81
  Top 0.152: X6.6 IC13.4
N$82
  Bottom 0.152: R38.2 48.26,10.16 IC14.4
N$83  (via drill 0.3)
  Top 0.152: 19.05,51.91 33.81,51.91 35.08,50.64 35.08,44.29 36.67,42.7 37.31,42.7 IC1.24 | 19.05,51.91 R52.2 13.97,52.07 13.81,52.23 10.16,52.23 D1.1 10.16,52.39 v9.37,53.18 | 19.05,51.91 C5.2
  Bottom 0.152: X6.8 3.97,53.18 v9.37,53.18
N$84  (via drill 0.3)
  Top 0.152: v29.53,33.02 29.53,39.37 32.07,41.91 33.97,41.91 34.77,41.12 37.31,41.12 IC1.26
  Bottom 0.152: v29.53,33.02 35.08,27.46 35.08,11.11 51.12,11.11 55.88,6.35 SV1.17
N$85  (via drill 0.3)
  Top 0.152: D2.1 27.78,50.96 27.94,50.8 R53.2 33.02,50.64 C6.2 33.02,50.8 v34.45,49.37 | v34.45,47.78 34.45,44.13 36.67,41.91 37.31,41.91 IC1.25
  Bottom 0.152: v34.45,49.37 34.45,48.26 | 34.45,48.26 v34.45,47.78 | 34.45,48.26 X6.10
N$86  (via drill 0.3)
  Top 0.152: v36.04,40.16 37.31,40.16 IC1.27
  Bottom 0.152: v36.04,40.16 39.53,36.67 50.32,36.67 64.61,22.38 64.61,0.64 60.33,0.64 SV1.18
N$87  (via drill 0.3)
  Top 0.152: 10.16,45.88 13.81,45.88 13.97,45.72 | 13.97,45.72 19.05,45.72 C7.2 | 13.97,45.72 R54.2 | v45.56,46.51 45.56,45.24 IC1.14 | 10.16,45.88 9.05,45.88 X7.2 | 10.16,45.88 D3.1
  Bottom 0.152: v45.56,46.51 45.24,46.2 9.37,46.2 X7.2
N$88
  Top 0.152: SV1.19 49.05,14.45 49.05,35.24 IC1.1
N$89  (via drill 0.3)
  Top 0.152: D4.1 27.78,44.61 27.94,44.45 R55.2 33.02,44.29 C8.2 33.02,44.45 v34.29,43.18 | v43.81,43.34 48.9,43.34 IC1.11
  Bottom 0.152: v43.81,43.34 43.66,43.18 v34.29,43.18 11.43,43.18 X7.4
N$90  (via drill 0.3)
  Top 0.152: v42.07,36.04 37.47,36.04 IC1.32
  Bottom 0.152: v42.07,36.04 50.48,36.04 63.5,23.02 SV1.20
N$91  (via drill 0.3)
  Top 0.152: v40.16,46.83 39.21,45.88 39.21,45.24 IC1.22
  Bottom 0.152: v40.16,46.83 34.92,52.07 34.92,66.04 SV3.5
N$92  (via drill 0.3)
  Top 0.152: 13.97,39.37 13.81,39.53 v12.54,39.53 D5.1 | 13.97,39.37 19.05,39.37 C9.2 | 13.97,39.37 R56.2 | v43.81,42.55 48.9,42.55 IC1.10
  Bottom 0.152: v43.81,42.55 42.07,40.8 14.13,40.8 12.7,39.37 | X7.6 12.7,39.37 | 12.7,39.37 v12.54,39.53
N$93  (via drill 0.3)
  Top 0.152: D6.1 13.81,33.18 13.97,33.02 | 13.97,33.02 19.05,33.02 C10.2 | 13.97,33.02 R57.2 | v44.77,34.92 44.77,33.66 IC1.41 | D6.1 8.73,33.18 4.76,29.21 2.86,29.21 2.06,28.42 2.06,27.15 X7.8 | D6.1
  Bottom 0.152: v44.77,34.92 44.13,34.29 15.72,34.29 6.83,25.4 X7.8
N$94  (via drill 0.3)
  Top 0.152: v40.01,43.81 40.01,45.09 IC1.21
  Bottom 0.152: v40.01,43.81 42.07,45.88 45.72,45.88 52.7,52.86 52.7,68.58 SV3.4
N$95
  Top 0.152: C12.2 37.47,29.84 36.51,30.8 Q1.1 36.51,30.96 39.05,33.5 IC1.34
N$96
  Top 0.152: C11.2 33.66,33.66 34.61,32.7 Q1.2 34.77,32.7 37.31,35.24 IC1.33
N$97  (via drill 0.3)
  Top 0.152: D7.1 13.81,26.83 13.97,26.67 | 13.97,26.67 19.05,26.67 C13.2 | 13.97,26.67 R58.2 | v45.56,34.92 45.56,33.66 IC1.42 | D7.1 3.81,20.48 X7.10 | D7.1
  Bottom 0.152: v45.56,34.92 44.61,33.97 17.46,33.97 X7.10
N$98
  Top 0.152: IC14.1 R59.1
N$99  (via drill 0.3)
  Top 0.152: v42.55,35.4 42.86,35.72 42.86,42.07 40.8,44.13 40.8,45.09 IC1.20 | v35.72,18.1 R59.2
  Bottom 0.152: v42.55,35.4 42.7,35.56 46.51,35.56 46.99,35.08 46.99,32.54 43.18,32.54 35.72,25.08 v35.72,18.1
N$100
  Top 0.152: C14.1 19.05,23.02 R60.1 13.97,22.86 13.81,22.7 10.16,22.7 D8.2 10.16,22.54 4.13,16.51 X5.1
N$101  (via drill 0.3)
  Top 0.152: 10.16,20.48 13.81,20.48 13.97,20.32 | 13.97,20.32 19.05,20.32 C14.2 | 13.97,20.32 R60.2 | v46.35,34.92 46.35,33.66 IC1.43 | 10.16,20.48 3.81,14.13 X5.2 | 10.16,20.48 D8.1
  Bottom 0.152: v46.35,34.92 45.09,33.66 23.5,33.66 X5.2
N$102
  Top 0.152: C15.1 19.05,16.67 R61.1 13.97,16.51 13.81,16.35 D9.2 10.16,16.19 5.4,11.43 X5.3
N$103
  Top 0.152: 10.16,14.13 13.81,14.13 13.97,13.97 R61.2 19.05,13.81 C15.2 19.05,13.97 23.81,18.73 37.47,18.73 47.15,28.42 47.15,33.5 IC1.44 | X5.4 4.92,8.89 10.16,14.13 | 10.16,14.13 D9.1
VDD  (via drill 0.3)
  Top 0.152: SV1.2 R39.1 | 45.4,29.53 45.72,29.21 C3.2 45.4,29.53 | 45.4,29.53 44.13,30.8 44.13,33.5 IC1.40 43.97,33.66 43.97,34.13 43.18,34.92 IC1.17 v43.18,47.62 | C4.2 33.02,40.64 34.29,39.37 IC1.28 37.94,39.37 38.42,39.85 38.42,44.13 38.26,44.29 38.26,46.2 40.8,48.74 42.39,48.74 42.86,49.21 | 43.18,53.5 R1.1 | 43.18,53.5 44.45,53.5 | 44.45,53.5 44.45,67.31 SV3.2 | 44.45,53.5 C2.2 | 42.86,49.21 43.18,49.53 43.18,53.5 | 42.86,49.21 v43.18,48.9 | v34.45,19.37 35.24,19.37 45.4,29.53
  Bottom 0.152: R38.3 46.67,9.21 32.7,9.21 | 32.7,9.21 23.81,9.21 23.34,9.68 18.57,9.68 R39.1 | X8.1 87.95,74.61 51.75,74.61 SV3.2 | v43.18,48.9 v43.18,47.62 | 32.7,9.21 32.7,19.37 v34.45,19.37
VDDCORENET
  Top 0.152: IC1.7 49.05,40.16 51.28,40.16 53.34,38.1 C1.2
VSS  (via drill 0.3)  (4 unrouted)
  Top 0.152: C8.1 33.02,47.15 R55.1 27.94,46.99 23.02,46.99 22.86,46.83 | D3.2 13.81,48.1 13.97,48.26 R54.1 19.05,48.42 C7.1 19.05,48.26 20.48,46.83 | 20.48,46.83 22.86,46.83 | 5.71,50.8 7.46,50.8 D3.2 | 5.71,50.8 X6.9 | D3.2 | 22.86,46.83 D4.2 | IC11.2 26.04,76.2 | 26.04,76.2 R42.1 | 26.04,60.96 IC13.2 17.94,54.77 | 26.04,60.96 R50.1 | IC12.2 26.04,68.58 | 26.04,68.58 R46.1 | 26.04,68.58 26.04,60.96 | 26.04,68.58 26.04,76.2 | C6.1 33.02,53.5 R53.1 27.94,53.34 23.02,53.34 D2.2 | 10.16,54.45 13.81,54.45 13.97,54.61 R52.1 17.94,54.77 | D2.2 20.48,53.18 19.05,54.61 C5.1 19.05,54.77 17.94,54.77 | 5.71,55.88 8.73,55.88 10.16,54.45 | 5.71,55.88 X6.7 | 10.16,54.45 D1.2 | D2.2 | 5.71,55.88 5.71,50.8 | 19.05,42.07 R56.1 13.97,41.91 13.81,41.75 D5.2 10.16,41.59 6.67,38.1 | 10.16,35.4 13.81,35.4 13.97,35.56 R57.1 19.05,35.72 C10.1 | 6.67,38.1 7.46,38.1 10.16,35.4 | 6.67,38.1 X7.3 | 10.16,35.4 D6.2 | IC1.29 37.31,38.42 33.34,38.42 33.02,38.1 C4.1 33.02,35.72 33.02,35.56 | IC1.39 43.18,29.21 C3.1 42.39,29.21 40.8,27.62 39.37,27.62 | X7.7 4.76,28.89 10.16,28.89 D7.2 13.81,29.05 13.97,29.21 R58.1 19.05,29.37 C13.1 19.05,29.21 29.05,29.21 29.2,29.18 | 20.48,46.83 20.48,43.5 19.05,42.07 | 19.05,42.07 C9.1 | IC3.2 R9.1 69.85,63.5 69.85,60.33 68.9,59.37 68.9,56.83 69.85,55.88 R12.1 71.91,55.88 | v44.13,47.62 44.13,45.24 IC1.16 | v44.13,49.37 44.13,50.32 44.45,50.64 C2.1 44.45,51.44 48.9,55.88 48.9,69.22 SV3.3 | R4.1 IC2.2 74.61,72.07 82.39,72.07 87.15,67.31 X8.2 | SV1.8 SV1.7 | SV1.9 SV1.10 | 73.34,10.16 71.91,10.16 | 71.91,10.16 R36.1 | IC9.2 71.91,17.78 | 71.91,17.78 R32.1 | 71.91,17.78 71.91,10.16 | IC8.2 71.91,25.4 | 71.91,25.4 R28.1 | IC7.2 71.91,33.02
  Top 0.152: 71.91,33.02 R24.1 | 71.91,33.02 71.91,25.4 | 71.91,25.4 71.91,17.78 | IC5.2 71.91,48.26 | 71.91,48.26 R16.1 | IC4.2 71.91,55.88 | 71.91,55.88 71.91,48.26 | v55.72,40.64 53.34,40.64 C1.1 | IC6.2 71.91,40.64 | 71.91,40.64 R20.1 | 71.91,40.64 71.91,48.26 | 71.91,40.64 71.91,33.02 | SV1.16 53.66,2.54 55.56,0.64 63.82,0.64 73.34,10.16 | 73.34,10.16 IC10.2
  Bottom 0.152: X7.1 2.06,41.43 2.06,38.1 | X7.3 2.06,38.1 | X7.9 2.06,24.61 2.06,27.94 | X7.7 2.06,27.94 | 2.06,27.94 2.06,31.27 X7.5 2.06,33.02 2.06,38.1 | v44.13,49.37 v44.13,47.62 | IC2.2 72.07,71.12 | 72.07,71.12 SV3.3 26.67,71.12 IC12.2 | IC3.2 72.07,65.09 72.07,71.12 | 22.86,4.45 R39.3 | 22.86,4.45 23.5,4.45 SV1.5 27.3,0.64 28.57,0.64 SV1.7 | SV1.1 17.14,4.45 22.86,4.45 | 52.07,4.45 52.07,2.54 SV1.16 | 52.07,4.45 R38.1 | 34.29,2.54 IC14.2 | SV1.8 34.29,2.54 | 34.29,2.54 SV1.9 | 52.07,4.45 40.01,4.45 SV1.10 | IC6.2 v55.72,40.64
  pour Top: 39.37,35.56 30.48,35.56 27.94,22.86 39.37,26.67
  pour Bottom (no thermals): 39.37,35.56 30.48,35.56 27.94,22.86 39.37,26.67